# EAGLE design Mabee_6Aixs IMU MPU6050 V1.0 (EAGLE 6.1)
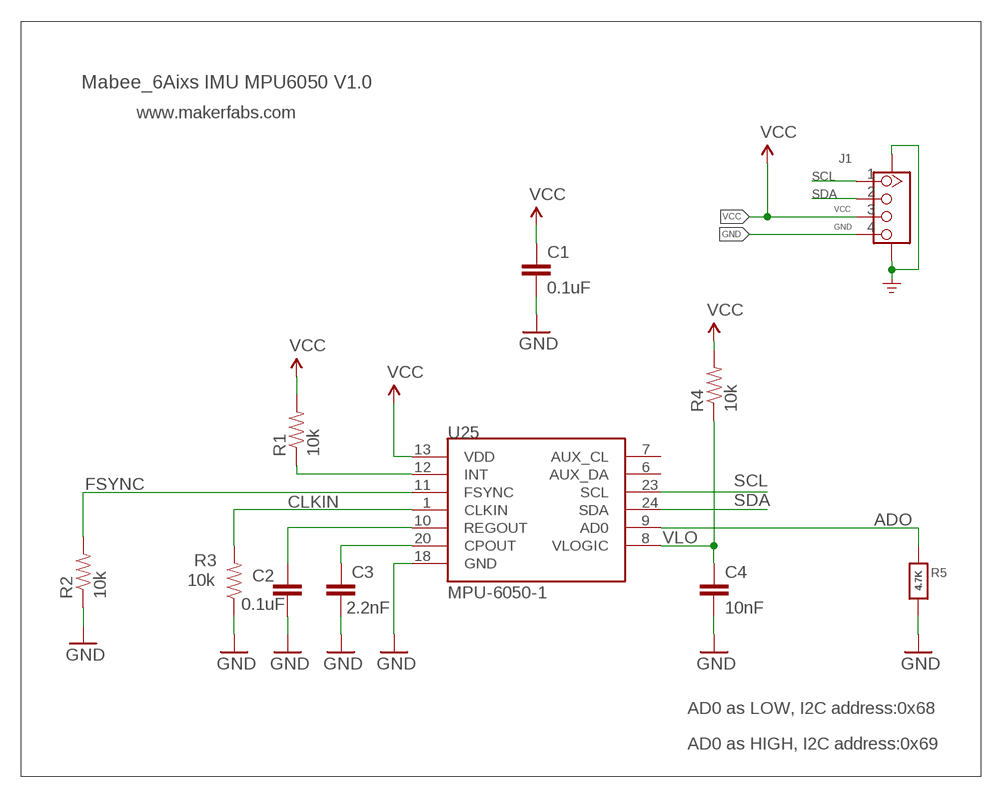
[diagram p0: schematic, sheet 1]

## Parts
C1  0.1uF  CAP0603-CAP  [0603-CAP]
C2  0.1uF  CAP0603-CAP  [0603-CAP]
C3  2.2nF  CAP0603-CAP  [0603-CAP]
C4  10nF  CAP0603-CAP  [0603-CAP]
J1  GROVE-CONNECTOR-SMD'90D'  [HW4-SMD-2.0-90D]
R1  10k  RESISTOR0603-RES  [0603-RES]
R2  10k  RESISTOR0603-RES  [0603-RES]
R3  10k  RESISTOR0603-RES  [0603-RES]
R4  10k  RESISTOR0603-RES  [0603-RES]
R5  4.7K  RESISTOR_0603_NOOUT  [0603-NO]
U25  MPU-6050-1  [QFN-24-4MM2]

## Nets
ADO: R5.1 U25.9(AD0)
CLKIN: R3.2 U25.1(CLKIN)
FSYNC: R2.2 U25.11(FSYNC)
GND: C1.2 C2.2 C3.2 C4.2 J1.4 J1.SS1 J1.SS2 R2.1 R3.1 R5.2 U25.18(GND)
IO35: R1.1 U25.12(INT)
N$49: C3.1 U25.20(CPOUT)
N$50: C2.1 U25.10(REGOUT)
SCL: J1.1 U25.23(SCL)
SDA: J1.2 U25.24(SDA)
VCC: C1.1 J1.3 R1.2 R4.2 U25.13(VDD)
VLO: C4.1 R4.1 U25.8(VLOGIC)
Unconnected: U25.6(AUX_DA) U25.7(AUX_CL)

## Notes on the sheet
- Mabee_6Aixs IMU MPU6050 V1.0
- www.makerfabs.com
- AD0 as LOW, I2C address:0x68
- AD0 as HIGH, I2C address:0x69

## Library data of the parts
C1-C4 = SparkFun:CAP: Capacitor Standard 0603 ceramic capacitor, and 0.1" leaded capacitor.
J1 = Connector-new:GROVE-CONNECTOR-SMD: 4P-SMD-2.0:320110030;4P-SMD-2.0-90D:320110032
R1-R4 = SparkFun:RESISTOR: Resistor Basic schematic elements and footprints for 0603, 1206, and PTH resistors.
R5 = microbuilder:RESISTOR: Resistors For new designs, use the packages preceded by an '_' character since they are more reliable: The following footprints should be used on most boards: _0402 - Standard footprint for regular board layouts _0603 - Standard footprint for regular board layouts _0805 - Standard footprint for regular board layouts _1206 - Standard footprint for regular board layouts For extremely tight-pitch boards where space is at a premium, the following 'micro-pitch' footprints can be used (smaller pads, no silkscreen outline, etc.): _0402MP - Micro-pitch footprint for very dense/compact boards _0603MP - Micro-pitch footprint for very dense/compact boards _0805MP - Micro-pitch footprint for very dense/compact boards _1206MP - Micro-pitch footprint for very dense/compact boards
U25 = Testing:MPU-6050

## Net classes
0 default: width 0.203 mm, drill 0.305 mm, clearance 0.152 mm

## Board
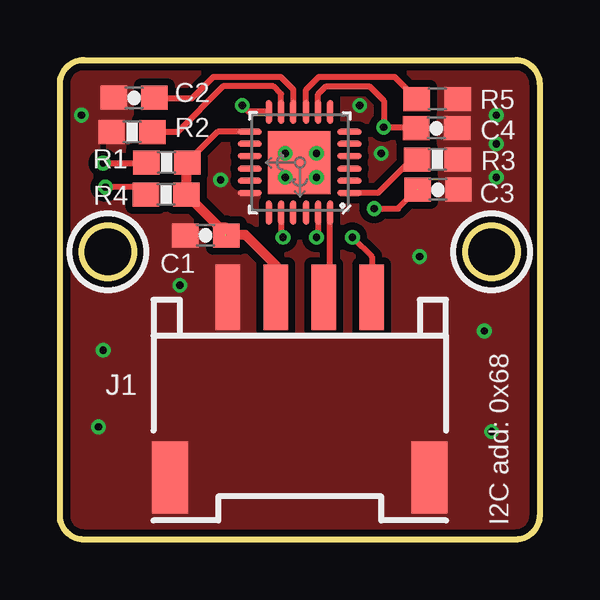
[diagram p1: board, top side]
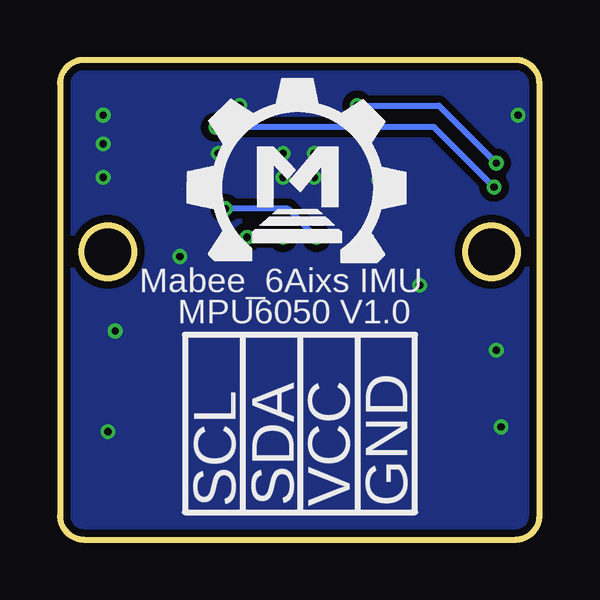
[diagram p2: board, bottom side, seen from below]

Size 20 x 20 mm. Coordinates in mm from the lower left corner, seen from the top.
Outline: 1,0 arc-90 0,1 0,19 arc-90 1,20 19,20 arc-90 20,19 20,1 arc-90 19,0 1,0
Outline: circle at 2,12 radius 1.1
Outline: circle at 18,12 radius 1.1
Copper layers (1*16): Top 0.035mm / dielectric 1.5mm / Bottom 0.035mm
Design rules: minimum track width 10mil, minimum drill 10mil, track to track 8mil, track to pad 8mil, pad to pad 8mil, via to via 8mil, smd to smd 0mil, copper to edge 10mil, drill to drill 8mil, minimum pad ring 10mil, minimum via ring 6mil, stop-mask expansion 4mil, vias tented up to drill 100mil, thermal gap 0mil

### Footprints (pad centres in the part's own frame; a part is rotated, then mirrored left to right if it is on the bottom)
0603-CAP = smd 1.1 x 1: 1 -0.85,0; 2 0.85,0
HW4-SMD-2.0-90D = smd 1.01 x 2.74: 1 -3,-0.1; 2 -1,-0.1; 3 1,-0.1; 4 3,-0.1 | smd 1.5 x 3: SS1 -5.4,7.4; SS2 5.4,7.4
0603-RES = smd 1.1 x 1: 1 -0.85,0; 2 0.85,0
0603-NO = smd 1.1 x 1: 1 -0.85,0; 2 0.85,0
QFN-24-4MM2 = smd 1.016 x 0.254: 1 -2.066,1.257; 2 -2.066,0.75; 3 -2.066,0.247; 4 -2.066,-0.287; 5 -2.066,-0.792; 6 -2.066,-1.297; 13 2.086,-1.297; 14 2.086,-0.792; 15 2.086,-0.287; 16 2.086,0.247; 17 2.086,0.75; 18 2.086,1.257 | smd 0.254 x 1.016: 7 -1.267,-2.122; 8 -0.762,-2.122; 9 -0.258,-2.122; 10 0.278,-2.122; 11 0.78,-2.122; 12 1.287,-2.122; 19 1.287,2.082; 20 0.78,2.082; 21 0.278,2.082; 22 -0.258,2.082; 23 -0.762,2.082; 24 -1.267,2.082 | smd 2.616 x 2.616: P$1 0.02,-0.01

### Placement (x,y rotation side)
C1  6.08,12.69 180 top
C2  3.09,18.42 180 top
C3  15.76,14.59 0 top
C4  15.71,17.15 0 top
J1  10,10 180 top
R1  4.45,15.73 0 top
R2  3,17 0 top
R3  15.74,15.85 180 top
R4  4.43,14.39 0 top
R5  15.73,18.37 0 top
U25  10,15.71 180 top
U$1  [MAKERFABS_0.3]  14.22,11.61 0 bottom

### Tracks (layer width: path | path; a pad name or v marks a point on that pad's centre or on a via)
ADO
  Top 0.254: U25.9 10.26,18.76 10.8,19.3 13.95,19.3 R5.1
CLKIN
  Top 0.254: R3.2 14.65,15.85 13.26,14.46 U25.1
FSYNC
  Top 0.254: R2.2 4.9,17 6.8,18.9 8.9,18.9 9.22,18.58 U25.11
GND  (via drill 0.3)
  other vias: 1.8,7.9 6.7,15 0.9,17.7 12.5,18.1 9.4,16.1 10.7,16.1 15,11.8 17.7,8.7 9.4,15.1 10.7,15.1 13.4,16.1 18.2,16.5 18.2,15.1 18.2,17.7 5,10.6 1.6,4.7 18,4.5
  pour Top (isolate 0.305): -2.3,12.4 -2.3,19.83 -1.03,21.1 8.8,21.1 20.33,21.1 21.6,19.83 21.6,13.1 21.6,-0.73 20.33,-2 8.7,-2 -1.03,-2 -2.3,-0.73
  pour Bottom (isolate 0.305): -2.7,9.4 -2.7,20.23 -1.43,21.5 8.5,21.5 20.73,21.5 22,20.23 22,10.8 22,-1.13 20.73,-2.4 10,-2.4 -1.43,-2.4 -2.7,-1.13
IO35  (via drill 0.3)
  Top 0.254: U25.12 7.87,17.83 v7.6,18.1 | v1.8,15.7 3.58,15.7 R1.1
  Bottom 0.254: v7.6,18.1 4.2,18.1 v1.8,15.7
N$49  (via drill 0.3)  (2 unrouted)
  Top 0.254: v13.1,13.8 14.1,13.8 C3.1 | U25.20 9.22,12.68 v9.3,12.6
  Bottom 0.254: v13.1,13.8 10.5,13.8 v9.3,12.6
N$50
  Top 0.254: C2.1 3.97,18.4 5.5,18.4 6.4,19.3 9.2,19.3 9.73,18.77 U25.10
SCL  (via drill 0.3)
  Top 0.254: U25.23 10.77,12.66 v10.7,12.6 | v12.2,12.6 13,11.8 J1.1
  Bottom 0.254: v10.7,12.6 v12.2,12.6
SDA
  Top 0.254: J1.2 11.27,10.37 U25.24
VCC  (1 unrouted)
  Top 0.254: U25.13 6.58,17.01 R1.2
  Top 0.406: J1.3 9,11.43 7.73,12.7 6.9,12.7 | C1.1 6.93,13 6.66,13 R4.2 5.28,15.7 R1.2
VLO  (via drill 0.3)
  Top 0.254: R4.1 3.26,14.7 v1.9,14.7 | C4.1 14.81,17.2 v13.5,17.2 13.5,18.3 12.9,18.9 11.1,18.9 10.77,18.57 U25.8
  Bottom 0.254: v1.9,14.7 4.4,17.2 v13.5,17.2

### Text on the board
tPlace: I2C add: 0x68
bPlace: Mabee_6Aixs IMU | MPU6050 V1.0
bNames: GND | VCC | SDA | SCL